# Altium schematic sheet FPGA_B34.SchDoc: HM-CORE FPGA B34
size A4; PageSetup: Record=PageOptions|CenterHorizontal=True|CenterVertical=True|PrintScale=0.96|XCorrection=1.00|YCorrection=1.00|PrintKind=0|BorderSize=5000000|LeftOffset=0|BottomOffset=0|Orientation=2|PaperLength=1000|PaperWidth=1000|Scale=100|PaperSource=7|PrintQuality=-4|MediaType=1|DitherType=10|PaperKind=A4|PrintScaleMode=1; Organization: Trenz Electronic GmbH; Revision: A; SheetNumber: 2; SheetTotal: 12; Date: 08.07.2015; Author: Indrek Tubalkain; CompanyName: Trenz Electronic GmbH; DrawnBy: Indrek Tubalkain; Engineer: Indrek Tubalkain; ProjectName: TE0723 Arduino
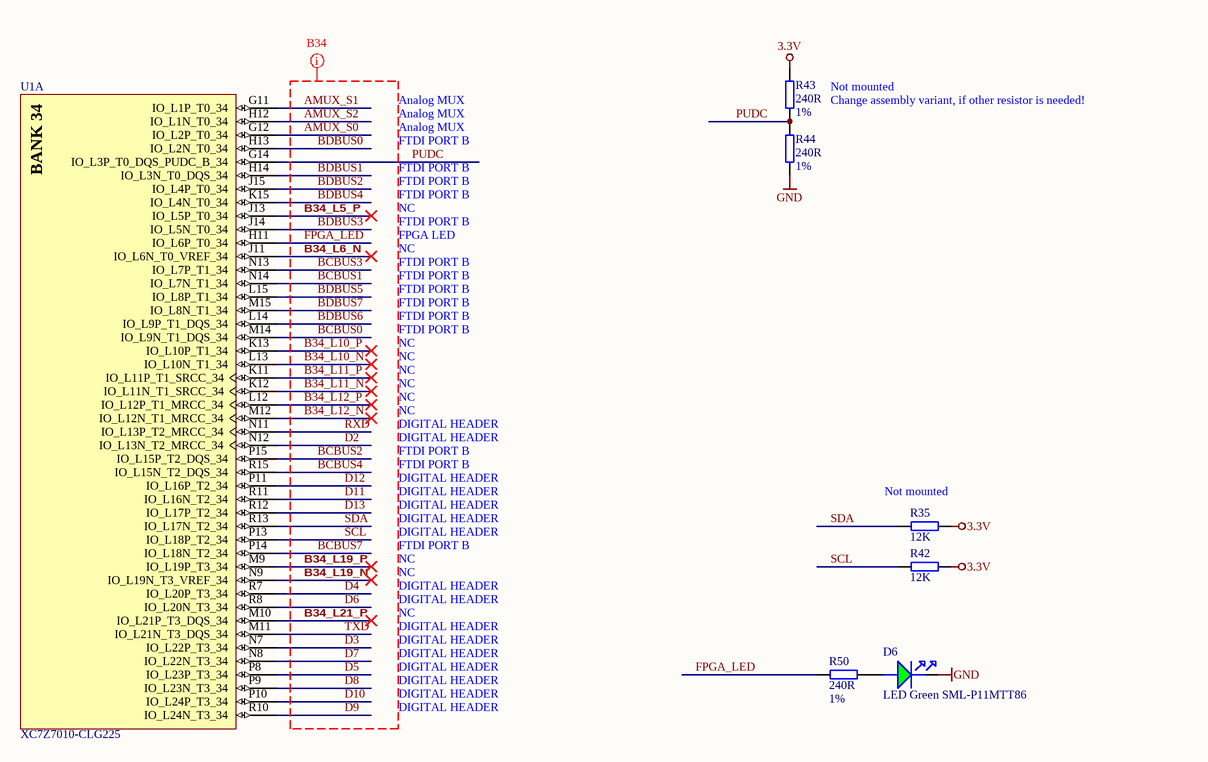
[diagram p0: FPGA_B34.SchDoc]

## Parts
D6  LED Green SML-P11MTT86  [LEDC1006X25N_GREEN]
R35  12K  [RESC1005X40N]
R42  12K  [RESC1005X40N]
R43  240R  Tolerance: 1%  [RESC1005X40N]
R44  240R  Tolerance: 1%  [RESC1005X40N]
R50  240R  Tolerance: 1%  [RESC1005X40N]
U1  XC7Z7010-CLG225  (part A of 8)

## Nets
3.3V: R35.2 R42.2 R43.1
GND: D6.K R44.2
AMUX_S0: U1.G12(IO_L2P_T0_34)
AMUX_S1: U1.G11(IO_L1P_T0_34)
AMUX_S2: U1.H12(IO_L1N_T0_34)
B34_L5_P: U1.J13(IO_L5P_T0_34)
B34_L6_N: U1.J11(IO_L6N_T0_VREF_34)
B34_L10_N: U1.L13(IO_L10N_T1_34)
B34_L10_P: U1.K13(IO_L10P_T1_34)
B34_L11_N: U1.K12(IO_L11N_T1_SRCC_34)
B34_L11_P: U1.K11(IO_L11P_T1_SRCC_34)
B34_L12_N: U1.M12(IO_L12N_T1_MRCC_34)
B34_L12_P: U1.L12(IO_L12P_T1_MRCC_34)
B34_L19_N: U1.N9(IO_L19N_T3_VREF_34)
B34_L19_P: U1.M9(IO_L19P_T3_34)
B34_L21_P: U1.M10(IO_L21P_T3_DQS_34)
BCBUS0: U1.M14(IO_L9N_T1_DQS_34)
BCBUS1: U1.N14(IO_L7N_T1_34)
BCBUS2: U1.P15(IO_L15P_T2_DQS_34)
BCBUS3: U1.N13(IO_L7P_T1_34)
BCBUS4: U1.R15(IO_L15N_T2_DQS_34)
BCBUS7: U1.P14(IO_L18N_T2_34)
BDBUS0: U1.H13(IO_L2N_T0_34)
BDBUS1: U1.H14(IO_L3N_T0_DQS_34)
BDBUS2: U1.J15(IO_L4P_T0_34)
BDBUS3: U1.J14(IO_L5N_T0_34)
BDBUS4: U1.K15(IO_L4N_T0_34)
BDBUS5: U1.L15(IO_L8P_T1_34)
BDBUS6: U1.L14(IO_L9P_T1_DQS_34)
BDBUS7: U1.M15(IO_L8N_T1_34)
D2: U1.N12(IO_L13N_T2_MRCC_34)
D3: U1.N7(IO_L22P_T3_34)
D4: U1.R7(IO_L20P_T3_34)
D5: U1.P8(IO_L23P_T3_34)
D6: U1.R8(IO_L20N_T3_34)
D7: U1.N8(IO_L22N_T3_34)
D8: U1.P9(IO_L23N_T3_34)
D9: U1.R10(IO_L24N_T3_34)
D10: U1.P10(IO_L24P_T3_34)
D11: U1.R11(IO_L16N_T2_34)
D12: U1.P11(IO_L16P_T2_34)
D13: U1.R12(IO_L17P_T2_34)
FPGA_LED: R50.2 U1.H11(IO_L6P_T0_34)
PUDC: R43.2 R44.1 U1.G14(IO_L3P_T0_DQS_PUDC_B_34)
RXD: U1.N11(IO_L13P_T2_MRCC_34)
SCL: R42.1 U1.P13(IO_L18P_T2_34)
SDA: R35.1 U1.R13(IO_L17N_T2_34)
TXD: U1.M11(IO_L21N_T3_DQS_34)
NetD6_A: D6.A R50.1

## Layout directives
net class B34: AMUX_S0, AMUX_S1, AMUX_S2, B34_L5_P, B34_L6_N, B34_L10_N, B34_L10_P, B34_L11_N, B34_L11_P, B34_L12_N, B34_L12_P, B34_L19_N, B34_L19_P, B34_L21_P, BCBUS0, BCBUS1, BCBUS2, BCBUS3, BCBUS4, BCBUS7, BDBUS0, BDBUS1, BDBUS2, BDBUS3, BDBUS4, BDBUS5, BDBUS6, BDBUS7, D2, D3, D4, D5, D6, D7, D8, D9, D10, D11, D12, D13, FPGA_LED, RXD, SCL, SDA, TXD

## Notes on the sheet
- FTDI PORT B
- Analog MUX
- Not mounted
- Change assembly variant, if other resistor is needed!
- NC
- FPGA LED
- DIGITAL HEADER
- (near R35) Not mounted
- Name:
- Size:
- A4
- Number:
- Revision:
- Designed by Trenz Electronic and changed by HMLAB
- OPEN SOURCE HARDWARE
- For more information, please visit: www.hm-lab.com/hm-core <http://hm-lab.com/hm-core>
- Date:
- Time:
- Sheet
- of
- (in symbol XC7Z7010-CLG225, part A) BANK 34

## Library data of the parts
D6 = 24211: LED Grün SML-P11MTT86 SMD; AN: 24211; Mixed: SMT; Preferred: Yes; Case: 1005 (0402); HelpURL: B:\AD\adlib\datasheet\SML-P1
R35 R42 = 22598: WID SMD 12K 1% 0,063W; AN: 22598; Mixed: SMT; Preferred: Yes; Case: 1005 (0402); Value: 12K
R43 R44 R50 = 23661: WID SMD 240R 1% 0,063W; AN: 23661; Mixed: SMT; Value: 240; Preferred: Yes; Case: 1005 (0402)